# Altium project ADC.PrjPcb
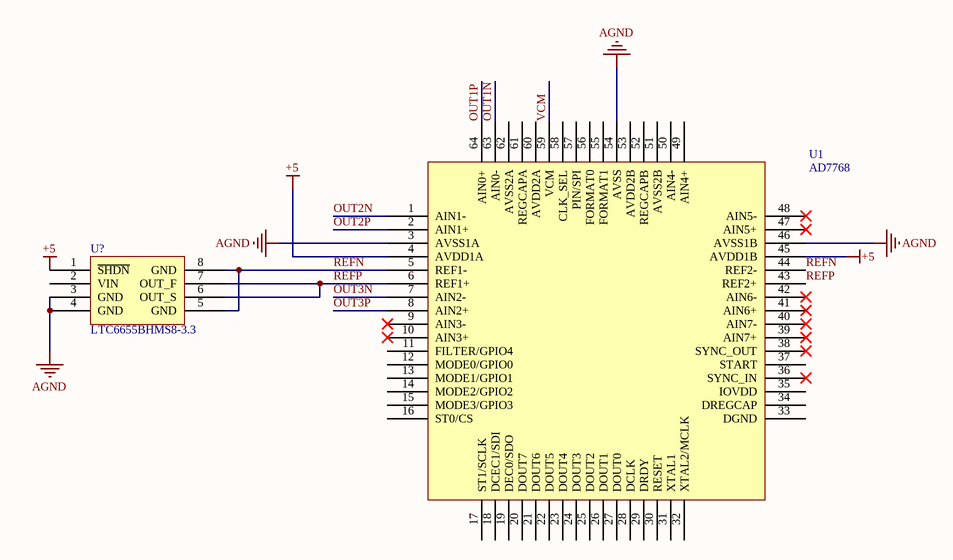
[diagram p0: ADC.SchDoc]
3 sheets, 9 parts. Net scope: global (net labels, ports and power ports of the same name join across sheets).
Board file: ADC.PcbDoc
Sheets:
  ADC.SchDoc
  LockIn.SchDoc
  IO.SchDoc

## Sheet ADC.SchDoc
size A

### Parts
U1  AD7768  [LQFP-64]
U?  LTC6655BHMS8-3.3  [MS-8]

### Nets
+5: U1.4(AVDD1A) U1.45(AVDD1B) U?.1(~{SHDN})
AGND: U1.3(AVSS1A) U1.46(AVSS1B) U1.54(AVSS) U?.3(GND) U?.4(GND)
OUT1N: U1.63(AIN0-)
OUT1P: U1.64(AIN0+)
OUT2N: U1.1(AIN1-)
OUT2P: U1.2(AIN1+)
OUT3N: U1.7(AIN2-)
OUT3P: U1.8(AIN2+)
REFN: U1.5(REF1-) U1.44(REF2-) U?.5(GND) U?.8(GND)
REFP: U1.6(REF1+) U1.43(REF2+) U?.6(OUT_S) U?.7(OUT_F)
VCM: U1.59(VCM)

Not connected (* = marked no-connect by the designer): U1 9(AIN3-)* 10(AIN3+)* 11(FILTER/GPIO4) 12(MODE0/GPIO0) 13(MODE1/GPIO1) 14(MODE2/GPIO2) 15(MODE3/GPIO3) 16(ST0/CS) 17(ST1/SCLK) 18(DCEC1/SDI) 19(DEC0/SDO) 20(DOUT7) 21(DOUT6) 22(DOUT5) 23(DOUT4) 24(DOUT3) 25(DOUT2) 26(DOUT1) 27(DOUT0) 28(DCLK) 29(DRDY) 30(RESET) 31(XTAL1) 32(XTAL2/MCLK) 33(DGND) 34(DREGCAP) 35(IOVDD) 36(SYNC_IN)* 37(START) 38(SYNC_OUT)* 39(AIN7+)* 40(AIN7-)* 41(AIN6+)* 42(AIN6-)* 47(AIN5+)* 48(AIN5-)* 49(AIN4+) 50(AIN4-) 51(AVSS2B) 52(REGCAPB) 53(AVDD2B) 55(FORMAT1) 56(FORMAT0) 57(PIN/SPI) 58(CLK_SEL) 60(AVDD2A) 61(REGCAPA) 62(AVSS2A); U? 2(VIN)

## Sheet LockIn.SchDoc
size A
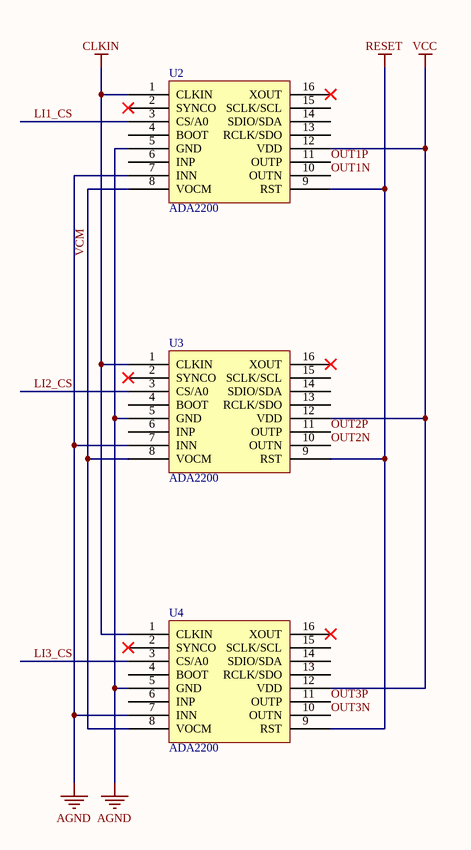
[diagram p1: LockIn.SchDoc]

### Parts
U2  ADA2200  [TSSOP-16]
U3  ADA2200  [TSSOP-16]
U4  ADA2200  [TSSOP-16]

### Nets
AGND: U2.5(GND) U2.7(INN) U3.5(GND) U3.7(INN) U4.5(GND) U4.7(INN)
CLKIN: U2.1(CLKIN) U3.1(CLKIN) U4.1(CLKIN)
RESET: U2.9(RST) U3.9(RST) U4.9(RST)
VCC: U2.12(VDD) U3.12(VDD) U4.12(VDD)
LI1_CS: U2.3(CS/A0)
LI2_CS: U3.3(CS/A0)
LI3_CS: U4.3(CS/A0)
OUT1N: U2.10(OUTN)
OUT1P: U2.11(OUTP)
OUT2N: U3.10(OUTN)
OUT2P: U3.11(OUTP)
OUT3N: U4.10(OUTN)
OUT3P: U4.11(OUTP)
VCM: U2.8(VOCM) U3.8(VOCM) U4.8(VOCM)

Not connected (* = marked no-connect by the designer): U2 2(SYNCO)* 4(BOOT) 6(INP) 13(RCLK/SDO) 14(SDIO/SDA) 15(SCLK/SCL) 16(XOUT)*; U3 2(SYNCO)* 4(BOOT) 6(INP) 13(RCLK/SDO) 14(SDIO/SDA) 15(SCLK/SCL) 16(XOUT)*; U4 2(SYNCO)* 4(BOOT) 6(INP) 13(RCLK/SDO) 14(SDIO/SDA) 15(SCLK/SCL) 16(XOUT)*

## Sheet IO.SchDoc
size A
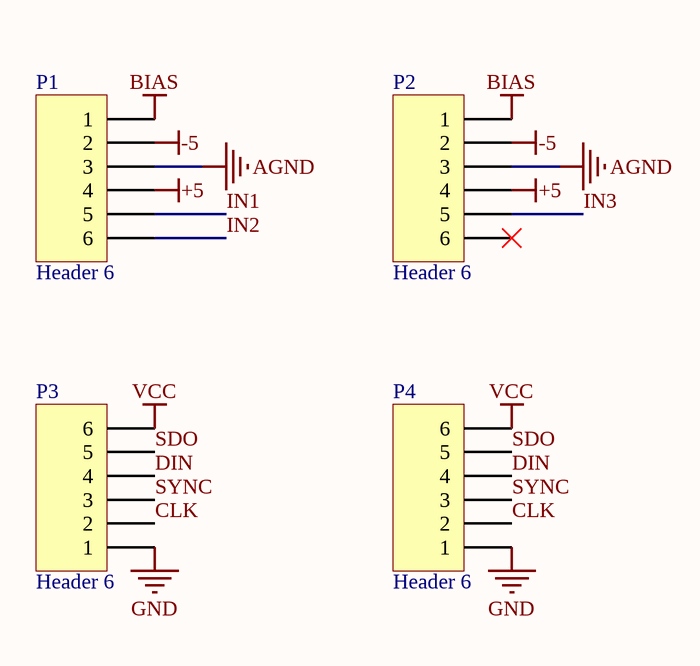
[diagram p2: IO.SchDoc]

### Parts
P1  Header 6  [HDR1X6]
P2  Header 6  [HDR1X6]
P3  Header 6  [HDR1X6]
P4  Header 6  [HDR1X6]

### Nets
+5: P1.4 P2.4
-5: P1.2 P2.2
AGND: P1.3 P2.3
BIAS: P1.1 P2.1
GND: P3.1 P4.1
VCC: P3.6 P4.6
CLK: P3.2 P4.2
DIN: P3.4 P4.4
IN1: P1.5
IN2: P1.6
IN3: P2.5
SDO: P3.5 P4.5
SYNC: P3.3 P4.3

Not connected (* = marked no-connect by the designer): P2 6*

### Library data of the parts
P1-P4 = Header 6: Header, 6-Pin; LatestRevisionDate: 17-Jul-2002; LatestRevisionNote: Re-released for DXP Platform.; Publisher: Altium Limited

## Nets that join several sheets
+5: ADC (U1.4 U1.45 U?.1), IO (P1.4 P2.4)
AGND: ADC (5 pins), LockIn (6 pins), IO (P1.3 P2.3)
VCC: LockIn (U2.12 U3.12 U4.12), IO (P3.6 P4.6)
OUT1N: ADC (U1.63), LockIn (U2.10)
OUT1P: ADC (U1.64), LockIn (U2.11)
OUT2N: ADC (U1.1), LockIn (U3.10)
OUT2P: ADC (U1.2), LockIn (U3.11)
OUT3N: ADC (U1.7), LockIn (U4.10)
OUT3P: ADC (U1.8), LockIn (U4.11)
VCM: ADC (U1.59), LockIn (U2.8 U3.8 U4.8)